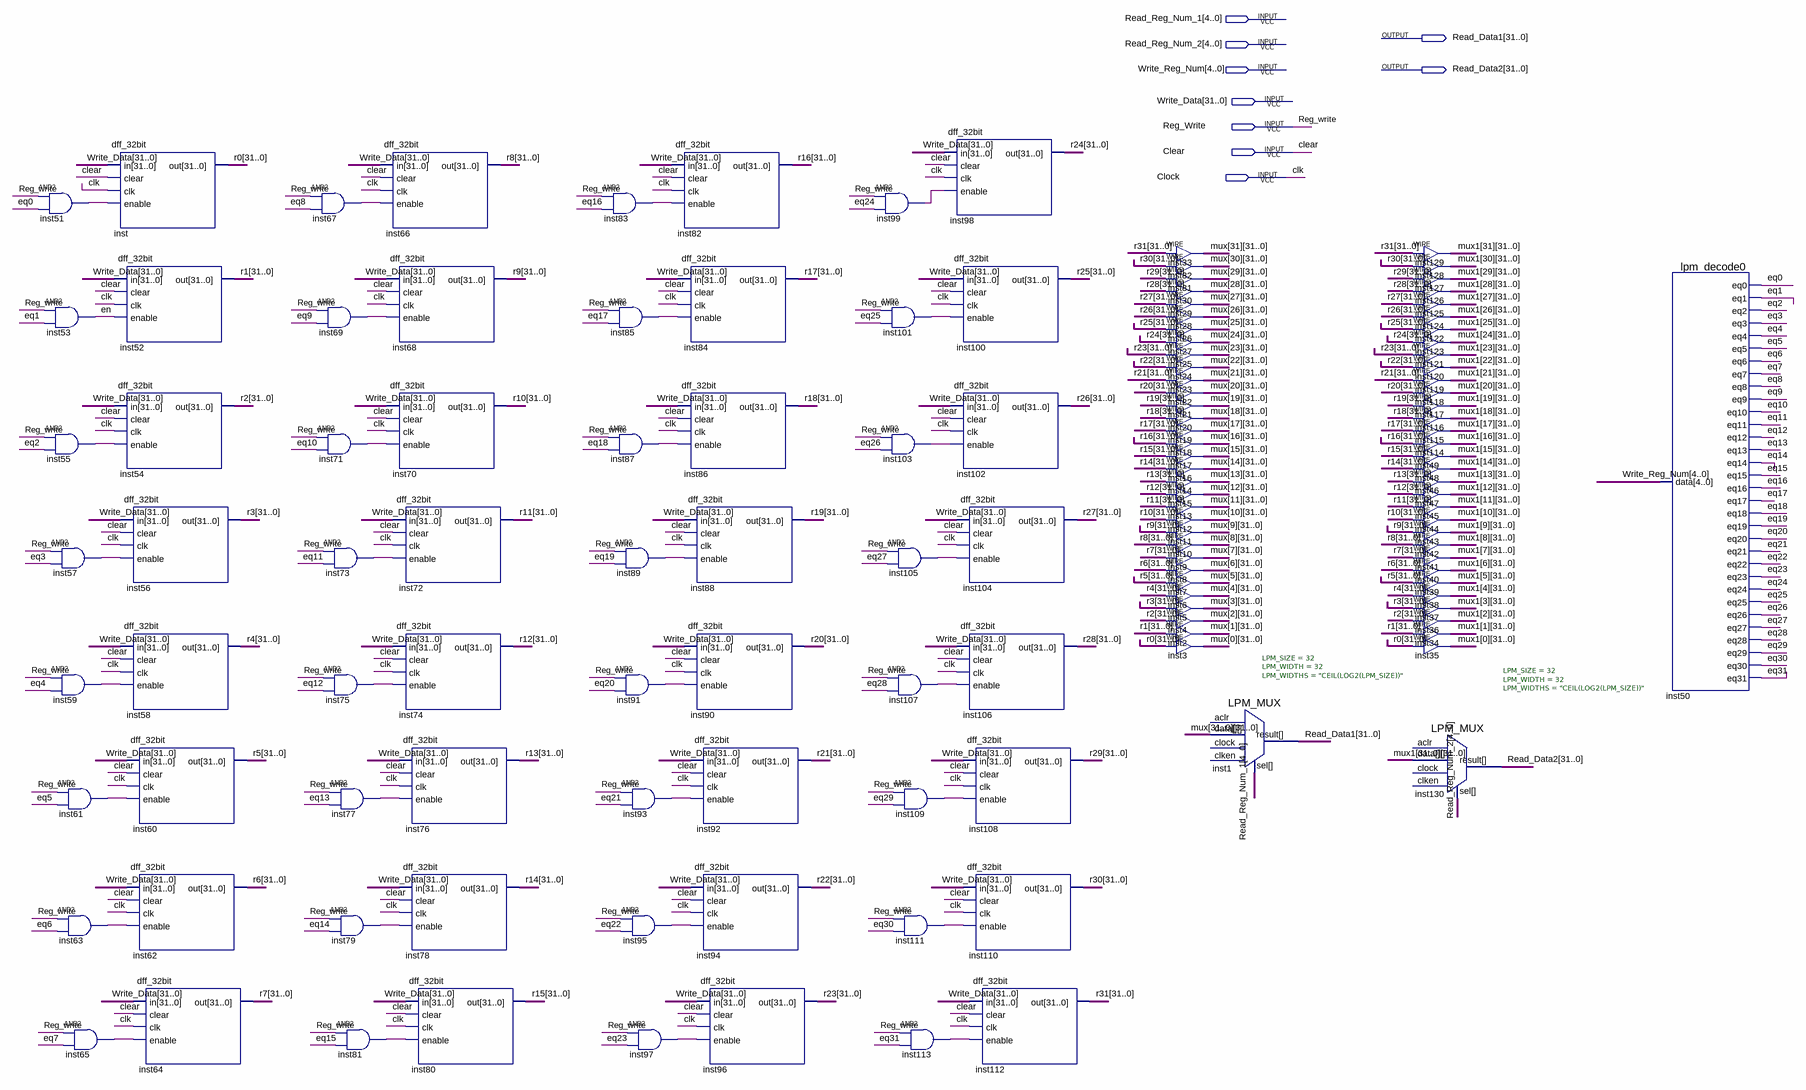
[diagram p0: schematic sheet]
// Quartus schematic Register_File.bdf as structural Verilog: 131 symbols, 9 pins
module Register_File (
  input  [4:0] Read_Reg_Num_1,
  input  [4:0] Read_Reg_Num_2,
  input  [4:0] Write_Reg_Num,
  input  [31:0] Write_Data,
  input  Reg_Write,
  input  Clear,
  input  Clock,
  output [31:0] Read_Data1,
  output [31:0] Read_Data2
);

  wire en, eq0, eq1, eq2, eq3, eq4, eq5, eq6, eq7, eq8, eq9, eq10, eq11, eq12, eq13, eq14, eq15, eq16, eq17,
       eq18, eq19, eq20, eq21, eq22, eq23, eq24, eq25, eq26, eq27, eq28, eq29, eq30, eq31, inst51_out,
       inst55_out, inst57_out, inst59_out, inst61_out, inst63_out, inst65_out, inst67_out, inst69_out,
       inst71_out, inst73_out, inst75_out, inst77_out, inst79_out, inst81_out, inst83_out, inst85_out,
       inst87_out, inst89_out, inst91_out, inst93_out, inst95_out, inst97_out, inst99_out, inst101_out,
       inst103_out, inst105_out, inst107_out, inst109_out, inst111_out, inst113_out;
  wire [31:0] mux1_0, mux1_1, mux1_2, mux1_3, mux1_4, mux1_5, mux1_6, mux1_7, mux1_8, mux1_9, mux1_10,
       mux1_11, mux1_12, mux1_13, mux1_14, mux1_15, mux1_16, mux1_17, mux1_18, mux1_19, mux1_20, mux1_21,
       mux1_22, mux1_23, mux1_24, mux1_25, mux1_26, mux1_27, mux1_28, mux1_29, mux1_30, mux1_31, mux_0,
       mux_1, mux_2, mux_3, mux_4, mux_5, mux_6, mux_7, mux_8, mux_9, mux_10, mux_11, mux_12, mux_13, mux_14,
       mux_15, mux_16, mux_17, mux_18, mux_19, mux_20, mux_21, mux_22, mux_23, mux_24, mux_25, mux_26,
       mux_27, mux_28, mux_29, mux_30, mux_31, r0, r1, r2, r3, r4, r5, r6, r7, r8, r9, r10, r11, r12, r13,
       r14, r15, r16, r17, r18, r19, r20, r21, r22, r23, r24, r25, r26, r27, r28, r29, r30, r31;

  and inst51 (inst51_out, Reg_Write, eq0);
  and inst53 (en, Reg_Write, eq1);
  and inst55 (inst55_out, Reg_Write, eq2);
  and inst57 (inst57_out, Reg_Write, eq3);
  and inst59 (inst59_out, Reg_Write, eq4);
  and inst61 (inst61_out, Reg_Write, eq5);
  and inst63 (inst63_out, Reg_Write, eq6);
  and inst65 (inst65_out, Reg_Write, eq7);
  dff_32bit inst (.in(Write_Data), .clear(Clear), .clk(Clock), .enable(inst51_out), .out(r0));
  dff_32bit inst52 (.in(Write_Data), .clear(Clear), .clk(Clock), .enable(en), .out(r1));
  dff_32bit inst54 (.in(Write_Data), .clear(Clear), .clk(Clock), .enable(inst55_out), .out(r2));
  dff_32bit inst56 (.in(Write_Data), .clear(Clear), .clk(Clock), .enable(inst57_out), .out(r3));
  dff_32bit inst58 (.in(Write_Data), .clear(Clear), .clk(Clock), .enable(inst59_out), .out(r4));
  dff_32bit inst60 (.in(Write_Data), .clear(Clear), .clk(Clock), .enable(inst61_out), .out(r5));
  dff_32bit inst62 (.in(Write_Data), .clear(Clear), .clk(Clock), .enable(inst63_out), .out(r6));
  dff_32bit inst64 (.in(Write_Data), .clear(Clear), .clk(Clock), .enable(inst65_out), .out(r7));
  and inst67 (inst67_out, Reg_Write, eq8);
  and inst69 (inst69_out, Reg_Write, eq9);
  and inst71 (inst71_out, Reg_Write, eq10);
  and inst73 (inst73_out, Reg_Write, eq11);
  and inst75 (inst75_out, Reg_Write, eq12);
  and inst77 (inst77_out, Reg_Write, eq13);
  and inst79 (inst79_out, Reg_Write, eq14);
  and inst81 (inst81_out, Reg_Write, eq15);
  dff_32bit inst66 (.in(Write_Data), .clear(Clear), .clk(Clock), .enable(inst67_out), .out(r8));
  dff_32bit inst68 (.in(Write_Data), .clear(Clear), .clk(Clock), .enable(inst69_out), .out(r9));
  dff_32bit inst70 (.in(Write_Data), .clear(Clear), .clk(Clock), .enable(inst71_out), .out(r10));
  dff_32bit inst72 (.in(Write_Data), .clear(Clear), .clk(Clock), .enable(inst73_out), .out(r11));
  dff_32bit inst74 (.in(Write_Data), .clear(Clear), .clk(Clock), .enable(inst75_out), .out(r12));
  dff_32bit inst76 (.in(Write_Data), .clear(Clear), .clk(Clock), .enable(inst77_out), .out(r13));
  dff_32bit inst78 (.in(Write_Data), .clear(Clear), .clk(Clock), .enable(inst79_out), .out(r14));
  dff_32bit inst80 (.in(Write_Data), .clear(Clear), .clk(Clock), .enable(inst81_out), .out(r15));
  and inst83 (inst83_out, Reg_Write, eq16);
  and inst85 (inst85_out, Reg_Write, eq17);
  and inst87 (inst87_out, Reg_Write, eq18);
  and inst89 (inst89_out, Reg_Write, eq19);
  and inst91 (inst91_out, Reg_Write, eq20);
  and inst93 (inst93_out, Reg_Write, eq21);
  and inst95 (inst95_out, Reg_Write, eq22);
  and inst97 (inst97_out, Reg_Write, eq23);
  dff_32bit inst82 (.in(Write_Data), .clear(Clear), .clk(Clock), .enable(inst83_out), .out(r16));
  dff_32bit inst84 (.in(Write_Data), .clear(Clear), .clk(Clock), .enable(inst85_out), .out(r17));
  dff_32bit inst86 (.in(Write_Data), .clear(Clear), .clk(Clock), .enable(inst87_out), .out(r18));
  dff_32bit inst88 (.in(Write_Data), .clear(Clear), .clk(Clock), .enable(inst89_out), .out(r19));
  dff_32bit inst90 (.in(Write_Data), .clear(Clear), .clk(Clock), .enable(inst91_out), .out(r20));
  dff_32bit inst92 (.in(Write_Data), .clear(Clear), .clk(Clock), .enable(inst93_out), .out(r21));
  dff_32bit inst94 (.in(Write_Data), .clear(Clear), .clk(Clock), .enable(inst95_out), .out(r22));
  dff_32bit inst96 (.in(Write_Data), .clear(Clear), .clk(Clock), .enable(inst97_out), .out(r23));
  and inst99 (inst99_out, Reg_Write, eq24);
  and inst101 (inst101_out, Reg_Write, eq25);
  and inst103 (inst103_out, Reg_Write, eq26);
  and inst105 (inst105_out, Reg_Write, eq27);
  and inst107 (inst107_out, Reg_Write, eq28);
  and inst109 (inst109_out, Reg_Write, eq29);
  and inst111 (inst111_out, Reg_Write, eq30);
  and inst113 (inst113_out, Reg_Write, eq31);
  dff_32bit inst98 (.in(Write_Data), .clear(Clear), .clk(Clock), .enable(inst99_out), .out(r24));
  dff_32bit inst100 (.in(Write_Data), .clear(Clear), .clk(Clock), .enable(inst101_out), .out(r25));
  dff_32bit inst102 (.in(Write_Data), .clear(Clear), .clk(Clock), .enable(inst103_out), .out(r26));
  dff_32bit inst104 (.in(Write_Data), .clear(Clear), .clk(Clock), .enable(inst105_out), .out(r27));
  dff_32bit inst106 (.in(Write_Data), .clear(Clear), .clk(Clock), .enable(inst107_out), .out(r28));
  dff_32bit inst108 (.in(Write_Data), .clear(Clear), .clk(Clock), .enable(inst109_out), .out(r29));
  dff_32bit inst110 (.in(Write_Data), .clear(Clear), .clk(Clock), .enable(inst111_out), .out(r30));
  dff_32bit inst112 (.in(Write_Data), .clear(Clear), .clk(Clock), .enable(inst113_out), .out(r31));
  assign mux_31 = r31;  // WIRE inst33
  assign mux_30 = r30;  // WIRE inst32
  assign mux_29 = r29;  // WIRE inst31
  assign mux_28 = r28;  // WIRE inst30
  assign mux_27 = r27;  // WIRE inst29
  assign mux_26 = r26;  // WIRE inst28
  assign mux_25 = r25;  // WIRE inst26
  assign mux_24 = r24;  // WIRE inst27
  assign mux_23 = r23;  // WIRE inst25
  assign mux_22 = r22;  // WIRE inst24
  assign mux_21 = r21;  // WIRE inst23
  assign mux_20 = r20;  // WIRE inst22
  assign mux_19 = r19;  // WIRE inst21
  assign mux_18 = r18;  // WIRE inst20
  assign mux_17 = r17;  // WIRE inst19
  assign mux_16 = r16;  // WIRE inst18
  assign mux_15 = r15;  // WIRE inst17
  assign mux_14 = r14;  // WIRE inst16
  assign mux_13 = r13;  // WIRE inst14
  assign mux_12 = r12;  // WIRE inst15
  assign mux_11 = r11;  // WIRE inst13
  assign mux_10 = r10;  // WIRE inst12
  assign mux_9 = r9;  // WIRE inst11
  assign mux_8 = r8;  // WIRE inst10
  assign mux_7 = r7;  // WIRE inst9
  assign mux_6 = r6;  // WIRE inst8
  assign mux_5 = r5;  // WIRE inst7
  assign mux_4 = r4;  // WIRE inst6
  assign mux_3 = r3;  // WIRE inst5
  assign mux_2 = r2;  // WIRE inst4
  assign mux_1 = r1;  // WIRE inst2
  assign mux_0 = r0;  // WIRE inst3
  LPM_MUX #(.LPM_SIZE(32), .LPM_WIDTH(32), .LPM_WIDTHS("CEIL(LOG2(LPM_SIZE))")) inst1 (
    .data({mux_31, mux_30, mux_29, mux_28, mux_27, mux_26, mux_25, mux_24, mux_23, mux_22, mux_21, mux_20, mux_19, mux_18, mux_17, mux_16, mux_15, mux_14, mux_13, mux_12, mux_11, mux_10, mux_9, mux_8, mux_7, mux_6, mux_5, mux_4, mux_3, mux_2, mux_1, mux_0}),
    .sel(Read_Reg_Num_1), .result(Read_Data1));  // open: clock, aclr, clken
  assign mux1_31 = r31;  // WIRE inst129
  assign mux1_30 = r30;  // WIRE inst128
  assign mux1_29 = r29;  // WIRE inst127
  assign mux1_28 = r28;  // WIRE inst126
  assign mux1_27 = r27;  // WIRE inst125
  assign mux1_26 = r26;  // WIRE inst124
  assign mux1_25 = r25;  // WIRE inst122
  assign mux1_24 = r24;  // WIRE inst123
  assign mux1_23 = r23;  // WIRE inst121
  assign mux1_22 = r22;  // WIRE inst120
  assign mux1_21 = r21;  // WIRE inst119
  assign mux1_20 = r20;  // WIRE inst118
  assign mux1_19 = r19;  // WIRE inst117
  assign mux1_18 = r18;  // WIRE inst116
  assign mux1_17 = r17;  // WIRE inst115
  assign mux1_16 = r16;  // WIRE inst114
  assign mux1_15 = r15;  // WIRE inst49
  assign mux1_14 = r14;  // WIRE inst48
  assign mux1_13 = r13;  // WIRE inst46
  assign mux1_12 = r12;  // WIRE inst47
  assign mux1_11 = r11;  // WIRE inst45
  assign mux1_10 = r10;  // WIRE inst44
  assign mux1_9 = r9;  // WIRE inst43
  assign mux1_8 = r8;  // WIRE inst42
  assign mux1_7 = r7;  // WIRE inst41
  assign mux1_6 = r6;  // WIRE inst40
  assign mux1_5 = r5;  // WIRE inst39
  assign mux1_4 = r4;  // WIRE inst38
  assign mux1_3 = r3;  // WIRE inst37
  assign mux1_2 = r2;  // WIRE inst36
  assign mux1_1 = r1;  // WIRE inst34
  assign mux1_0 = r0;  // WIRE inst35
  LPM_MUX #(.LPM_SIZE(32), .LPM_WIDTH(32), .LPM_WIDTHS("CEIL(LOG2(LPM_SIZE))")) inst130 (
    .data({mux1_31, mux1_30, mux1_29, mux1_28, mux1_27, mux1_26, mux1_25, mux1_24, mux1_23, mux1_22, mux1_21, mux1_20, mux1_19, mux1_18, mux1_17, mux1_16, mux1_15, mux1_14, mux1_13, mux1_12, mux1_11, mux1_10, mux1_9, mux1_8, mux1_7, mux1_6, mux1_5, mux1_4, mux1_3, mux1_2, mux1_1, mux1_0}),
    .sel(Read_Reg_Num_2), .result(Read_Data2));  // open: clock, aclr, clken
  lpm_decode0 inst50 (
    .data(Write_Reg_Num), .eq0(eq0), .eq1(eq1), .eq2(eq2), .eq3(eq3), .eq4(eq4), .eq5(eq5), .eq6(eq6),
    .eq7(eq7), .eq8(eq8), .eq9(eq9), .eq10(eq10), .eq11(eq11), .eq12(eq12), .eq13(eq13), .eq14(eq14),
    .eq15(eq15), .eq16(eq16), .eq17(eq17), .eq18(eq18), .eq19(eq19), .eq20(eq20), .eq21(eq21), .eq22(eq22),
    .eq23(eq23), .eq24(eq24), .eq25(eq25), .eq26(eq26), .eq27(eq27), .eq28(eq28), .eq29(eq29), .eq30(eq30),
    .eq31(eq31));

  // Other names for the same wires on the sheet: clk = Clock
endmodule
